# EAGLE schematic wind vane (EAGLE 6.4)
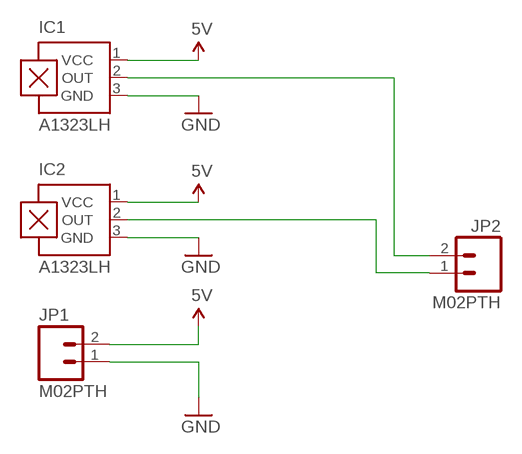
[diagram p0: schematic, sheet 1]

## Parts
IC1  A1323LH  [SOT23-W]
IC2  A1323LH  [SOT23-W]
JP1  M02PTH  [1X02]
JP2  M02PTH  [1X02]

## Nets
5V: IC1.1(VCC) IC2.1(VCC) JP1.2
GND: IC1.3(GND) IC2.3(GND) JP1.1
N$7: IC1.2(OUT) JP2.2
N$8: IC2.2(OUT) JP2.1

## Library data of the parts
IC1 IC2 = allegro:A13*?: Linear Hall Effect Sensor ICs Continuous-Time Ratiometric High-Temperature Operation Programmable Linear with Analog Output A1302 -Replacement- UGN3503 Source: http://www.allegromicro.com/en/Products/Part_Numbers/1301/1301.pdf http://www.allegromicro.com/en/Products/Part_Numbers/1321/1321.pdf http://www.allegromicro.com/en/Products/Part_Numbers/1381/1381.pdf; MF: ALLEGRO MICROSYSTEMS, INC.; MPN: A1323LLHLT-T; OC_FARNELL: 1651968; OC_NEWARK: 65K5152
JP1 JP2 = SparkFun-Connectors:M02: Standard 2-pin 0.1" header. Use with - straight break away headers ( PRT-00116) - right angle break away headers (PRT-00553) - swiss pins (PRT-00743) - machine pins (PRT-00117) - female headers (PRT-00115) Molex polarized connector foot print use with: PRT-08233 with associated crimp pins and housings. 2.54_SCREWTERM for use with PRT-10571. 3.5mm Screw Terminal footprints for PRT-08084 5mm Screw Terminal footprints for use with PRT-08433